# Altium schematic sheet Sheet1.SchDoc
size A4
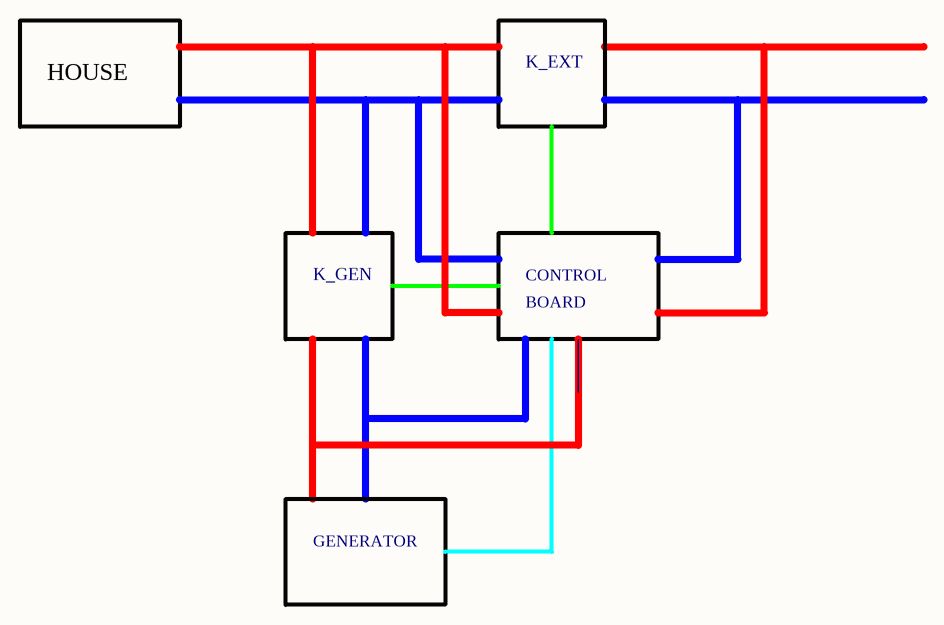
[diagram p0: Sheet1.SchDoc]

## Notes on the sheet
- HOUSE
- K_EXT
- K_GEN
- CONTROL
- BOARD
- GENERATOR